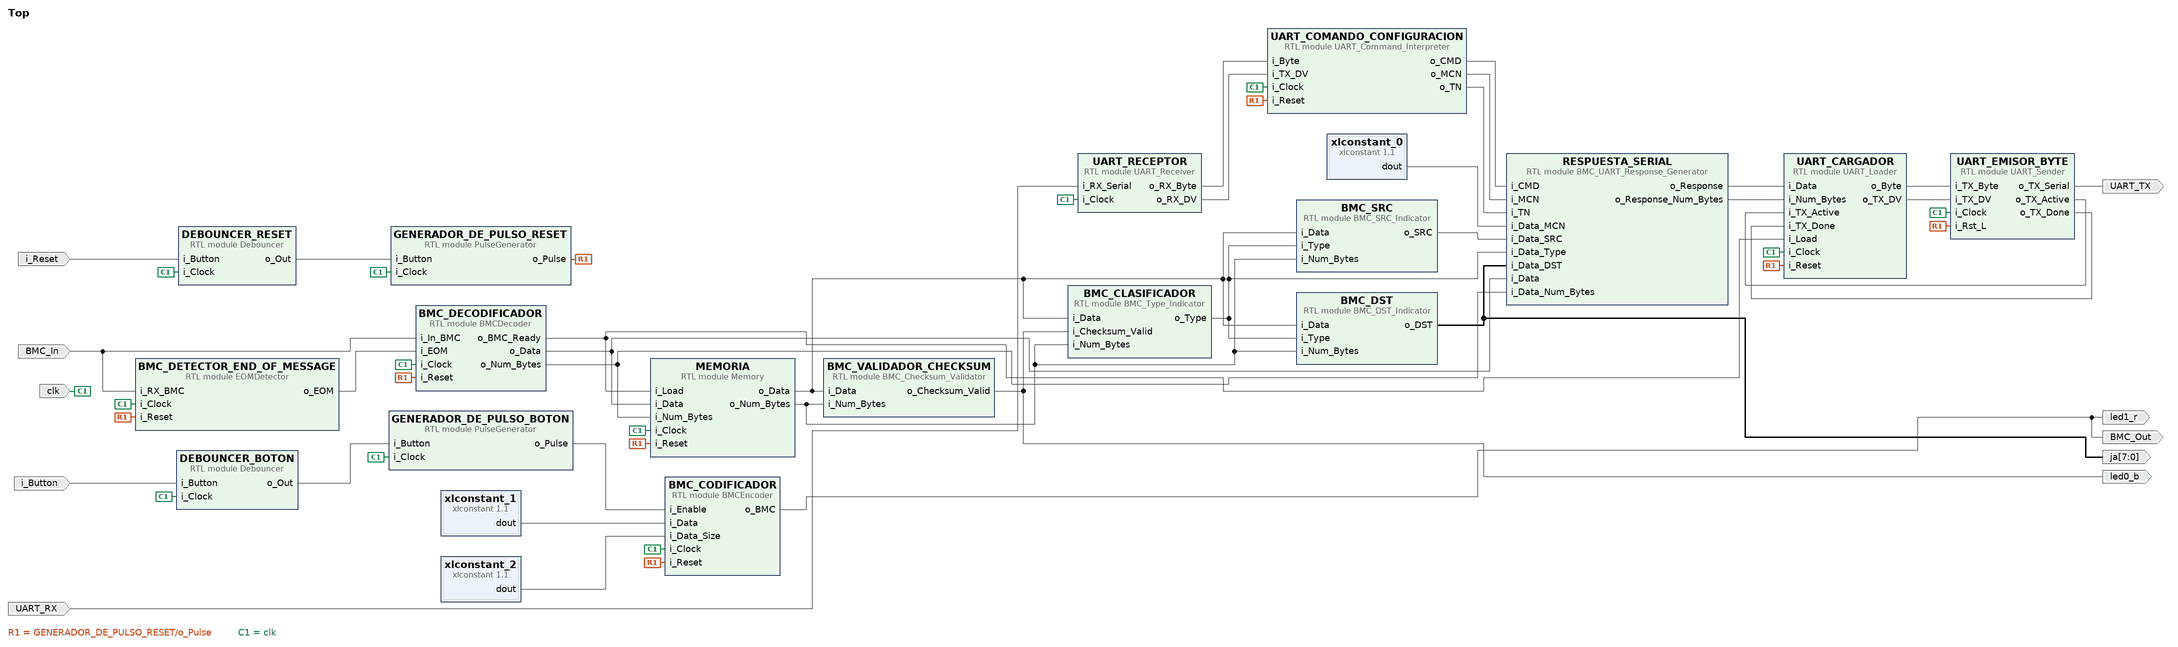
[diagram p0: block diagram of the top level]
# Vivado block design Top, xc7z020clg484-1, Vivado 2023.2
create_bd_design Top

create_bd_port -dir I -type clk clk
create_bd_port -dir I UART_RX
create_bd_port -dir I i_Reset
create_bd_port -dir I i_Button
create_bd_port -dir O UART_TX
create_bd_port -dir O BMC_Out
create_bd_port -dir I BMC_In
create_bd_port -dir O led1_r
create_bd_port -dir O -from 7 -to 0 ja
create_bd_port -dir O led0_b

create_bd_cell -type module -reference UART_Receiver UART_RECEPTOR
set_property -dict {CONFIG.CLKS_PER_BIT 272} [get_bd_cells UART_RECEPTOR]
create_bd_cell -type module -reference UART_Command_Interpreter UART_COMANDO_CONFIGURACION
create_bd_cell -type module -reference BMC_Checksum_Validator BMC_VALIDADOR_CHECKSUM
create_bd_cell -type module -reference BMC_DST_Indicator BMC_DST
create_bd_cell -type module -reference BMC_SRC_Indicator BMC_SRC
create_bd_cell -type module -reference BMC_Type_Indicator BMC_CLASIFICADOR
create_bd_cell -type module -reference BMC_UART_Response_Generator RESPUESTA_SERIAL
create_bd_cell -type module -reference Debouncer DEBOUNCER_RESET
create_bd_cell -type module -reference PulseGenerator GENERADOR_DE_PULSO_RESET
create_bd_cell -type ip -vlnv xilinx.com:ip:xlconstant:1.1 xlconstant_0
set_property -dict {CONFIG.CONST_VAL 0 CONFIG.CONST_WIDTH 8} [get_bd_cells xlconstant_0]
create_bd_cell -type module -reference UART_Loader UART_CARGADOR
create_bd_cell -type module -reference PulseGenerator GENERADOR_DE_PULSO_BOTON
create_bd_cell -type module -reference Debouncer DEBOUNCER_BOTON
create_bd_cell -type module -reference UART_Sender UART_EMISOR_BYTE
set_property -dict {CONFIG.CLKS_PER_BIT 272} [get_bd_cells UART_EMISOR_BYTE]
create_bd_cell -type module -reference BMCEncoder BMC_CODIFICADOR
set_property -dict {CONFIG.CLKS_PER_BIT 42} [get_bd_cells BMC_CODIFICADOR]
create_bd_cell -type ip -vlnv xilinx.com:ip:xlconstant:1.1 xlconstant_1
set_property -dict {CONFIG.CONST_VAL 0xC269D53FFF CONFIG.CONST_WIDTH 1024} [get_bd_cells xlconstant_1]
create_bd_cell -type ip -vlnv xilinx.com:ip:xlconstant:1.1 xlconstant_2
set_property -dict {CONFIG.CONST_VAL 40 CONFIG.CONST_WIDTH 17} [get_bd_cells xlconstant_2]
create_bd_cell -type module -reference EOMDetector BMC_DETECTOR_END_OF_MESSAGE
set_property -dict {CONFIG.CLKS_PER_BIT 42} [get_bd_cells BMC_DETECTOR_END_OF_MESSAGE]
create_bd_cell -type module -reference BMCDecoder BMC_DECODIFICADOR
set_property -dict {CONFIG.CLKS_PER_BIT 42} [get_bd_cells BMC_DECODIFICADOR]
create_bd_cell -type module -reference Memory MEMORIA

# ---- connections ----

connect_bd_net -net BMCDecoder_0_o_BMC_Ready [get_bd_pins BMC_DECODIFICADOR/o_BMC_Ready] \
  [get_bd_pins MEMORIA/i_Load] [get_bd_pins UART_CARGADOR/i_Load]
connect_bd_net -net BMCEncoder_0_o_BMC [get_bd_pins BMC_CODIFICADOR/o_BMC] [get_bd_ports BMC_Out] [get_bd_ports led1_r]
connect_bd_net -net BMC_Checksum_Validat_0_o_Checksum_Valid [get_bd_pins BMC_VALIDADOR_CHECKSUM/o_Checksum_Valid] \
  [get_bd_ports led0_b] [get_bd_pins BMC_CLASIFICADOR/i_Checksum_Valid]
connect_bd_net -net BMC_DST_Indicator_1_o_DST [get_bd_pins BMC_DST/o_DST] [get_bd_pins RESPUESTA_SERIAL/i_Data_DST] [get_bd_ports ja]
connect_bd_net [get_bd_ports BMC_In] [get_bd_pins BMC_DETECTOR_END_OF_MESSAGE/i_RX_BMC] [get_bd_pins BMC_DECODIFICADOR/i_In_BMC]
connect_bd_net -net BMC_SRC_Indicator_1_o_SRC [get_bd_pins BMC_SRC/o_SRC] [get_bd_pins RESPUESTA_SERIAL/i_Data_SRC]
connect_bd_net -net BMC_Type_Indicator_1_o_Type [get_bd_pins BMC_CLASIFICADOR/o_Type] \
  [get_bd_pins BMC_SRC/i_Type] [get_bd_pins RESPUESTA_SERIAL/i_Data_Type] [get_bd_pins BMC_DST/i_Type]
connect_bd_net -net Debouncer_0_o_Out [get_bd_pins DEBOUNCER_RESET/o_Out] [get_bd_pins GENERADOR_DE_PULSO_RESET/i_Button]
connect_bd_net -net Debouncer_1_o_Out [get_bd_pins DEBOUNCER_BOTON/o_Out] [get_bd_pins GENERADOR_DE_PULSO_BOTON/i_Button]
connect_bd_net -net EJEMPLO_BR_dout [get_bd_pins BMC_DECODIFICADOR/o_Data] [get_bd_pins MEMORIA/i_Data] [get_bd_pins RESPUESTA_SERIAL/i_Data]
connect_bd_net -net EOMDetector_0_o_EOM [get_bd_pins BMC_DETECTOR_END_OF_MESSAGE/o_EOM] [get_bd_pins BMC_DECODIFICADOR/i_EOM]
connect_bd_net -net Memory_0_o_Data [get_bd_pins MEMORIA/o_Data] \
  [get_bd_pins BMC_SRC/i_Data] [get_bd_pins BMC_DST/i_Data] [get_bd_pins BMC_CLASIFICADOR/i_Data] \
  [get_bd_pins BMC_VALIDADOR_CHECKSUM/i_Data]
connect_bd_net -net Memory_0_o_Num_Bytes [get_bd_pins MEMORIA/o_Num_Bytes] \
  [get_bd_pins BMC_SRC/i_Num_Bytes] [get_bd_pins BMC_DST/i_Num_Bytes] [get_bd_pins BMC_CLASIFICADOR/i_Num_Bytes] \
  [get_bd_pins BMC_VALIDADOR_CHECKSUM/i_Num_Bytes]
connect_bd_net -net N_EJEMPLO_BR_dout [get_bd_pins BMC_DECODIFICADOR/o_Num_Bytes] \
  [get_bd_pins MEMORIA/i_Num_Bytes] [get_bd_pins RESPUESTA_SERIAL/i_Data_Num_Bytes]
connect_bd_net -net PulseGenerator_0_o_Pulse [get_bd_pins GENERADOR_DE_PULSO_RESET/o_Pulse] \
  [get_bd_pins UART_COMANDO_CONFIGURACION/i_Reset] [get_bd_pins UART_EMISOR_BYTE/i_Rst_L] \
  [get_bd_pins BMC_DETECTOR_END_OF_MESSAGE/i_Reset] [get_bd_pins BMC_CODIFICADOR/i_Reset] [get_bd_pins MEMORIA/i_Reset] \
  [get_bd_pins UART_CARGADOR/i_Reset] [get_bd_pins BMC_DECODIFICADOR/i_Reset]
connect_bd_net -net PulseGenerator_1_o_Pulse [get_bd_pins GENERADOR_DE_PULSO_BOTON/o_Pulse] [get_bd_pins BMC_CODIFICADOR/i_Enable]
connect_bd_net [get_bd_pins RESPUESTA_SERIAL/o_Response] [get_bd_pins UART_CARGADOR/i_Data]
connect_bd_net [get_bd_pins RESPUESTA_SERIAL/o_Response_Num_Bytes] [get_bd_pins UART_CARGADOR/i_Num_Bytes]
connect_bd_net -net UART_COMANDO_o_CMD [get_bd_pins UART_COMANDO_CONFIGURACION/o_CMD] [get_bd_pins RESPUESTA_SERIAL/i_CMD]
connect_bd_net -net UART_COMANDO_o_MCN [get_bd_pins UART_COMANDO_CONFIGURACION/o_MCN] [get_bd_pins RESPUESTA_SERIAL/i_MCN]
connect_bd_net -net UART_COMANDO_o_TN [get_bd_pins UART_COMANDO_CONFIGURACION/o_TN] [get_bd_pins RESPUESTA_SERIAL/i_TN]
connect_bd_net -net UART_Loader_0_o_Byte [get_bd_pins UART_CARGADOR/o_Byte] [get_bd_pins UART_EMISOR_BYTE/i_TX_Byte]
connect_bd_net -net UART_Loader_0_o_TX_DV [get_bd_pins UART_CARGADOR/o_TX_DV] [get_bd_pins UART_EMISOR_BYTE/i_TX_DV]
connect_bd_net -net UART_RX_o_RX_Byte [get_bd_pins UART_RECEPTOR/o_RX_Byte] [get_bd_pins UART_COMANDO_CONFIGURACION/i_Byte]
connect_bd_net -net UART_RX_o_RX_DV [get_bd_pins UART_RECEPTOR/o_RX_DV] [get_bd_pins UART_COMANDO_CONFIGURACION/i_TX_DV]
connect_bd_net -net UART_Sender_0_o_TX_Active [get_bd_pins UART_EMISOR_BYTE/o_TX_Active] [get_bd_pins UART_CARGADOR/i_TX_Active]
connect_bd_net -net UART_Sender_0_o_TX_Done [get_bd_pins UART_EMISOR_BYTE/o_TX_Done] [get_bd_pins UART_CARGADOR/i_TX_Done]
connect_bd_net -net UART_Sender_0_o_TX_Serial [get_bd_pins UART_EMISOR_BYTE/o_TX_Serial] [get_bd_ports UART_TX]
connect_bd_net -net i_Button_0_1 [get_bd_ports i_Button] [get_bd_pins DEBOUNCER_BOTON/i_Button]
connect_bd_net -net i_Clock_0_1 [get_bd_ports clk] \
  [get_bd_pins UART_RECEPTOR/i_Clock] [get_bd_pins UART_COMANDO_CONFIGURACION/i_Clock] \
  [get_bd_pins GENERADOR_DE_PULSO_RESET/i_Clock] [get_bd_pins DEBOUNCER_RESET/i_Clock] [get_bd_pins DEBOUNCER_BOTON/i_Clock] \
  [get_bd_pins GENERADOR_DE_PULSO_BOTON/i_Clock] [get_bd_pins UART_EMISOR_BYTE/i_Clock] \
  [get_bd_pins BMC_DETECTOR_END_OF_MESSAGE/i_Clock] [get_bd_pins BMC_CODIFICADOR/i_Clock] [get_bd_pins MEMORIA/i_Clock] \
  [get_bd_pins UART_CARGADOR/i_Clock] [get_bd_pins BMC_DECODIFICADOR/i_Clock]
connect_bd_net -net i_RX_Serial_0_1 [get_bd_ports UART_RX] [get_bd_pins UART_RECEPTOR/i_RX_Serial]
connect_bd_net [get_bd_ports i_Reset] [get_bd_pins DEBOUNCER_RESET/i_Button]
connect_bd_net [get_bd_pins xlconstant_0/dout] [get_bd_pins RESPUESTA_SERIAL/i_Data_MCN]
connect_bd_net [get_bd_pins xlconstant_1/dout] [get_bd_pins BMC_CODIFICADOR/i_Data]
connect_bd_net [get_bd_pins xlconstant_2/dout] [get_bd_pins BMC_CODIFICADOR/i_Data_Size]

validate_bd_design
save_bd_design
